# EAGLE design Test_Board (EAGLE 9.6.0)
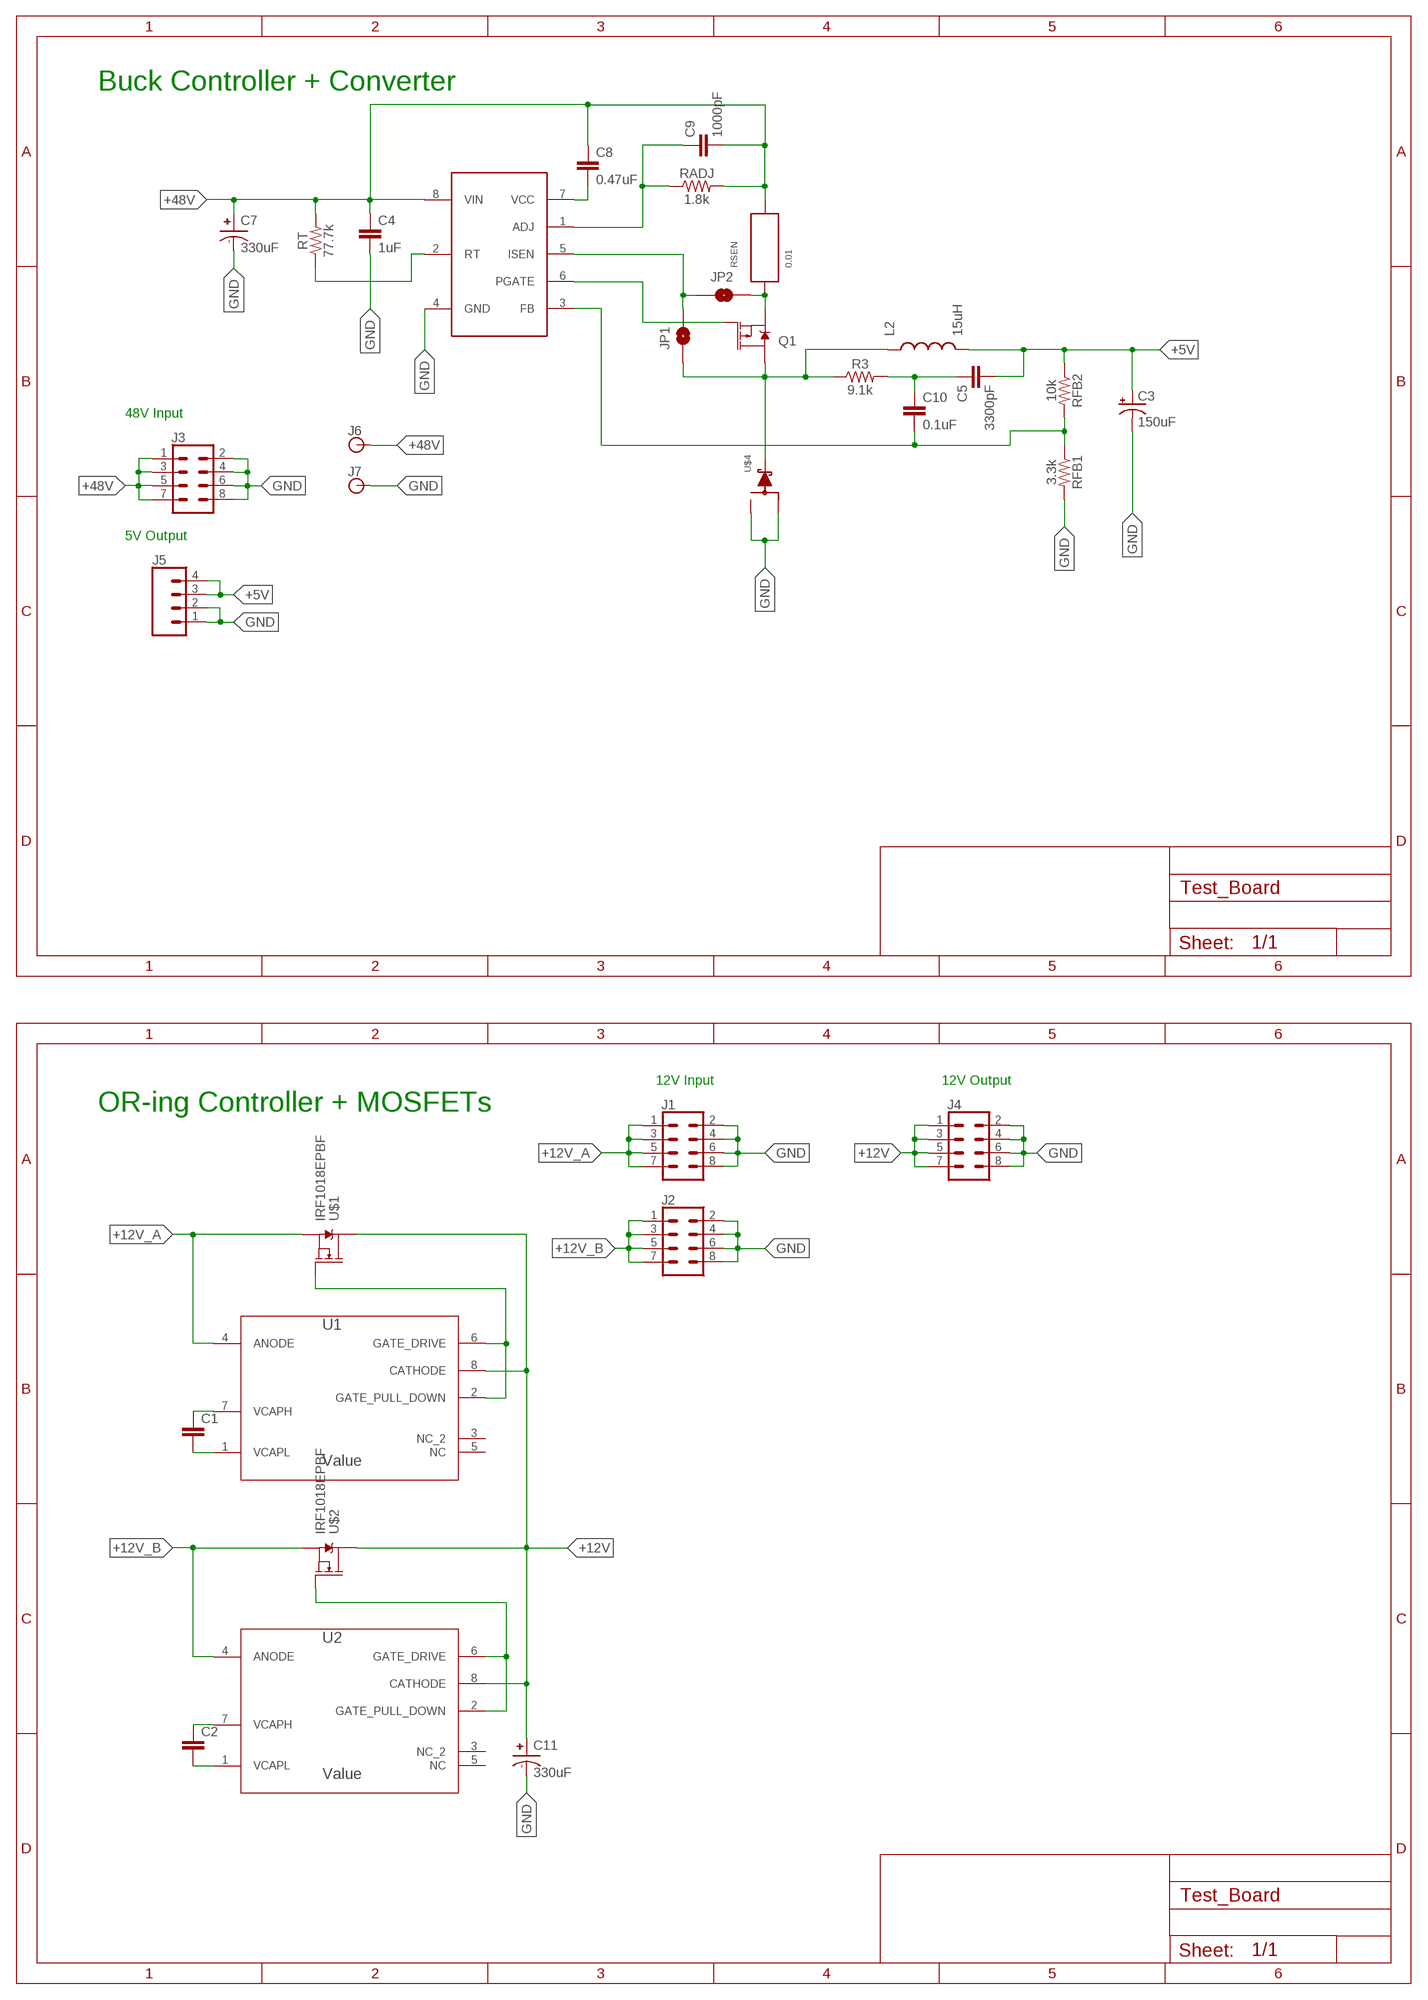
[diagram p0: schematic, sheet 1]

## Parts
C1  0.1UF-0603-100V-10%  [0603]
C2  0.1UF-0603-100V-10%  [0603]
C3  150uF  C-TANTALUM(10UF_150UF)  [CTAN(7.30_4.30MM)]
C4  1uF  0.1UF-0603-25V-(+80/-20%)  [0603]
C5  3300pF  0.1UF-0603-25V-(+80/-20%)  [0603]
C7  330uF  UCM1H331MNL1GS  [CAPAE1030X1050N]
C8  0.47uF  0.1UF-0603-25V-5%  [0603]
C9  1000pF  0.1UF-0603-25V-5%  [0603]
C10  0.1uF  0.1UF-0603-25V-(+80/-20%)  [0603]
C11  330uF  UCM1H331MNL1GS  [CAPAE1030X1050N]
J1  CONN_04X2  [2X4]
J2  CONN_04X2  [2X4]
J3  CONN_04X2  [2X4]
J4  CONN_04X2  [2X4]
J5  CONN_041X04_NO_SILK  [1X04_NO_SILK]
J6  BANANA_CONN  [BANANA_CONN]
J7  BANANA_CONN  [BANANA_CONN]
JP1  JUMPER-SMT_2_NO_NO-SILK  [SMT-JUMPER_2_NO_NO-SILK]
JP2  JUMPER-SMT_2_NO_NO-SILK  [SMT-JUMPER_2_NO_NO-SILK]
L2  15uH  HCMA1305  [HCMA1305]
Q1  MOSFET_PCH-NDS8434  [SO08]
R3  9.1k  RESISTOR0603  [0603]
RADJ  1.8k  RESISTOR0603  [0603]
RFB1  3.3k  RESISTOR0603  [0603]
RFB2  10k  RESISTOR0603  [0603]
RSEN  0.01  CSS2H-2512  [CSS2H-2512]
RT  77.7k  RESISTOR0603  [0603]
U1  Value  DIST_OR_DIODEDGK0008A_M  [DGK0008A_M]
U2  Value  DIST_OR_DIODEDGK0008A_M  [DGK0008A_M]
U$1  IRF1018EPBF  [TO263]
U$2  IRF1018EPBF  [TO263]
U$3  LM5085  [LM5085]
U$4  SWITCHMODE_SCHOTTKY  [DPAK-3]

## Nets
+5V: C3.+ C5.2 J5.3 J5.4 L2.2 RFB2.1
+12V: C11.+ J4.1 J4.3 J4.5 J4.7 U1.8(CATHODE) U2.8(CATHODE) U$1.3(D) U$2.3(D)
+12V_A: J1.1 J1.3 J1.5 J1.7 U1.4(ANODE) U$1.2(S)
+12V_B: J2.1 J2.3 J2.5 J2.7 U2.4(ANODE) U$2.2(S)
+48V: C4.1 C7.+ C8.1 C9.2 J3.1 J3.3 J3.5 J3.7 J6.P$1 RADJ.2 RSEN.2 RT.2 U$3.8(VIN)
FB: C10.2 RFB1.1 RFB2.2 U$3.3(FB)
GATE: Q1.4(G) U$3.6(PGATE)
GND: C3.- C4.2 C7.- C11.- J1.2 J1.4 J1.6 J1.8 J2.2 J2.4 J2.6 J2.8 J3.2 J3.4 J3.6 J3.8 J4.2 J4.4 J4.6 J4.8 J5.1 J5.2 J7.P$1 RFB1.2 U$3.4(GND) U$4.P$1 U$4.P$3
ISEN: JP1.2 JP2.1 U$3.5(ISEN)
N$2: C9.1 RADJ.1 U$3.1(ADJ)
N$5: C2.1 U2.7(VCAPH)
N$6: C2.2 U2.1(VCAPL)
N$7: C1.2 U1.1(VCAPL)
N$9: C1.1 U1.7(VCAPH)
N$10: U1.2(GATE_PULL_DOWN) U1.6(GATE_DRIVE) U$1.1(G)
N$12: C5.1 C10.1 R3.2
N$13: U2.2(GATE_PULL_DOWN) U2.6(GATE_DRIVE) U$2.1(G)
N$14: JP2.2 Q1.1(S) Q1.2(S) Q1.3(S) RSEN.1
RT: RT.1 U$3.2(RT)
SW: JP1.1 L2.1 Q1.5(D) Q1.6(D) Q1.7(D) Q1.8(D) R3.1 U$4.P$4
VCC: C8.2 U$3.7(VCC)
Unconnected: U1.3(NC_2) U1.5(NC) U2.3(NC_2) U2.5(NC)

## Notes on the sheet
- Buck Controller + Converter
- 48V Input
- 5V Output
- 12V Input | 12V Output
- OR-ing Controller + MOSFETs

## Library data of the parts
C1 C2 = SparkFun-Capacitors:0.1UF: 0.1µF ceramic capacitors A capacitor is a passive two-terminal electrical component used to store electrical energy temporarily in an electric field.; PROD_ID: CAP-08390; VALUE: 0.1uF
C3 = PowerComponents:C-TANTALUM(10UF_150UF)
C4 C5 = SparkFun-Capacitors:0.1UF: 0.1µF ceramic capacitors A capacitor is a passive two-terminal electrical component used to store electrical energy temporarily in an electric field.; PROD_ID: CAP-00810; VALUE: 0.1uF
C7 C11 = brick-capacitor-UCM1H331MNL1GS:UCM1H331MNL1GS: Nichicon 330uF 50 V Aluminium Electrolytic Capacitor SMD, CM Series 2000h 10 (Dia.) x 10mm Source: Datasheet <http://www.nichicon.co.jp/english/products/pdfs/e-ucm.pdf>; ARROW_PART_NUMBER: UCM1H331MNL1GS; ARROW_PRICE-STOCK: https://www.arrow.com/en/products/ucm1h331mnl1gs/nichicon; DESCRIPTION: Nichicon 330uF 50 V Aluminium Electrolytic Capacitor SMD, CM Series 2000h 10 (Dia.) x 10mm; HEIGHT: 10.5mm; MANUFACTURER_NAME: Nichicon; MANUFACTURER_PART_NUMBER: UCM1H331MNL1GS; MOUSER_PART_NUMBER: 647-UCM1H331MNL1GS; MOUSER_PRICE-STOCK: https://www.mouser.co.uk/ProductDetail/Nichicon/UCM1H331MNL1GS?qs=DSgADHjnLTkTovFLdbC%252BNg%3D%3D
C8 C9 = SparkFun-Capacitors:0.1UF: 0.1µF ceramic capacitors A capacitor is a passive two-terminal electrical component used to store electrical energy temporarily in an electric field.; PROD_ID: CAP-08604; VALUE: 0.1uF
C10 = SparkFun-Capacitors:0.1UF: 0.1µF ceramic capacitors A capacitor is a passive two-terminal electrical component used to store electrical energy temporarily in an electric field.; PROD_ID: CAP-00810
J1-J4 = SparkFun-Connectors:CONN_04X2: Multi connection point. Often used as Generic Header-pin footprint for 0.1 inch spaced/style header connections On any of the 0.1 inch spaced packages, you can populate with these: Break Away Headers - Straight <https://www.sparkfun.com/products/116> (PRT-00116) Break Away Male Headers - Right Angle <https://www.sparkfun.com/products/553> (PRT-00553) Female Headers <https://www.sparkfun.com/products/115> (PRT-00115) Break Away Headers - Machine Pin <https://www.sparkfun.com/products/117> (PRT-00117) Break Away Female Headers - Swiss Machine Pin <https://www.sparkfun.com/products/743> (PRT-00743)
J5 = SparkFun-Connectors:CONN_04: Multi connection point. Often used as Generic Header-pin footprint for 0.1 inch spaced/style header connections On any of the 0.1 inch spaced packages, you can populate with these: Break Away Headers - Straight <https://www.sparkfun.com/products/116> (PRT-00116) Break Away Male Headers - Right Angle <https://www.sparkfun.com/products/553> (PRT-00553) Female Headers <https://www.sparkfun.com/products/115> (PRT-00115) Break Away Headers - Machine Pin <https://www.sparkfun.com/products/117> (PRT-00117) Break Away Female Headers - Swiss Machine Pin <https://www.sparkfun.com/products/743> (PRT-00743) For SCREWTERMINALS and SPRING TERMINALS visit here: Screw Terimnals on SparkFun.com <https://www.sparkfun.com/search/results?term=Screw+Terminals> (5mm/3.5mm/2.54mm spacing) This device is also useful as a general connection point to wire up your design to another part of your project. Our various solder wires solder well into these plated through hole pads. Hook-Up Wire - Assortment (Stranded, 22 AWG) <https://www.sparkfun.com/products/11375> (PRT-11375) Hook-Up Wire - Assortment (Solid Core, 22 AWG) <https://www.sparkfun.com/products/11367> (PRT-11367) View the entire wire category on our website here <https://www.sparkfun.com/categories/141> Special notes: Molex polarized connector foot print use with SKU : PRT-08231 with associated crimp pins and housings. 1MM SMD Version SKU: PRT-10208; PROD_ID: CONN-09696
J6 J7 = SparkFun-Connectors:BANANA_CONN: Through-hole Banana Jack Basic PTH connection for banana jack plugs SparkFun Products: Multimeter Kit <https://www.sparkfun.com/products/retired/10956> Banana to Alligator Cable <https://www.sparkfun.com/products/retired/509> Banana to Alligator Coax Cable <https://www.sparkfun.com/products/retired/508> Banana to Banana Cable <https://www.sparkfun.com/products/retired/507> Banana to IC Hook Cables <https://www.sparkfun.com/products/retired/506>
JP1 JP2 = SparkFun-Jumpers:JUMPER-SMT_2_NO: Normally open jumper This jumper has two pads in close proximity to each other. Apply solder to close the connection. Round pads are easier to solder for beginners, but are a lot larger. SparkFun Product that uses the round pads: SparkFun EL Sequencer <https://www.sparkfun.com/products/12781>
L2 = Inductor_15uH - hcma1305:HCMA1305: Eaton HCMA1305-150-R Inductor
Q1 = SparkFun-DiscreteSemi:MOSFET_PCH: P-channel MOSFETs Voltage controlled devices that allow control of high current outputs. SparkFun Products: SparkFun ESP32 Thing <https://www.sparkfun.com/products/13907> SparkFun ESP8266 Thing <https://www.sparkfun.com/products/13231>; PROD_ID: TRANS-08355; VALUE: 6.5A/20V/35mΩ
R3 RADJ RFB1 RFB2 RT = SparkFun-Resistors:RESISTOR: Generic Resistor Package
RSEN = INA4181A4:CSS2H-2512
U1 U2 = Dist_OR_Controller:DIST_OR_DIODE; APPLICATION_BUILDNUMBER: *; COMPTYPE: IC; MANUFACTURER: Texas Instruments; MOUNTTYPE: SMT; PACKAGEREFERENCE: DGK0008A; PARTNUMBER: LM74610QDGKRQ1; PIN_COUNT: 8; REFDES: RefDes; TYPE: TYPE
U$1 U$2 = Reverse_Voltage_NMOS:IRF1018EPBF
U$3 = Buck_Controller:LM5085
U$4 = PowerComponents:SWITCHMODE_SCHOTTKY: {Digi-Key Part Number: MBRD835LT4GOSCT-ND} {Voltage - DC Reverse (Vr) (Max): 35V} {Current - Average Rectified (Io): 8A} {Voltage - Forward (Vf) (Max) @ If: 510mV @ 8A} {Speed: Fast Recovery =< 500ns, > 200mA (Io)} {Current - Reverse Leakage @ Vr: 1.4mA @ 35V} {Mounting Type: Surface Mount} {Package / Case: TO-252-3, DPak (2 Leads + Tab), SC-63} {Supplier Device Package: DPAK-3} {Operating Temperature - Junction: -65°C ~ 150°C}

## Board
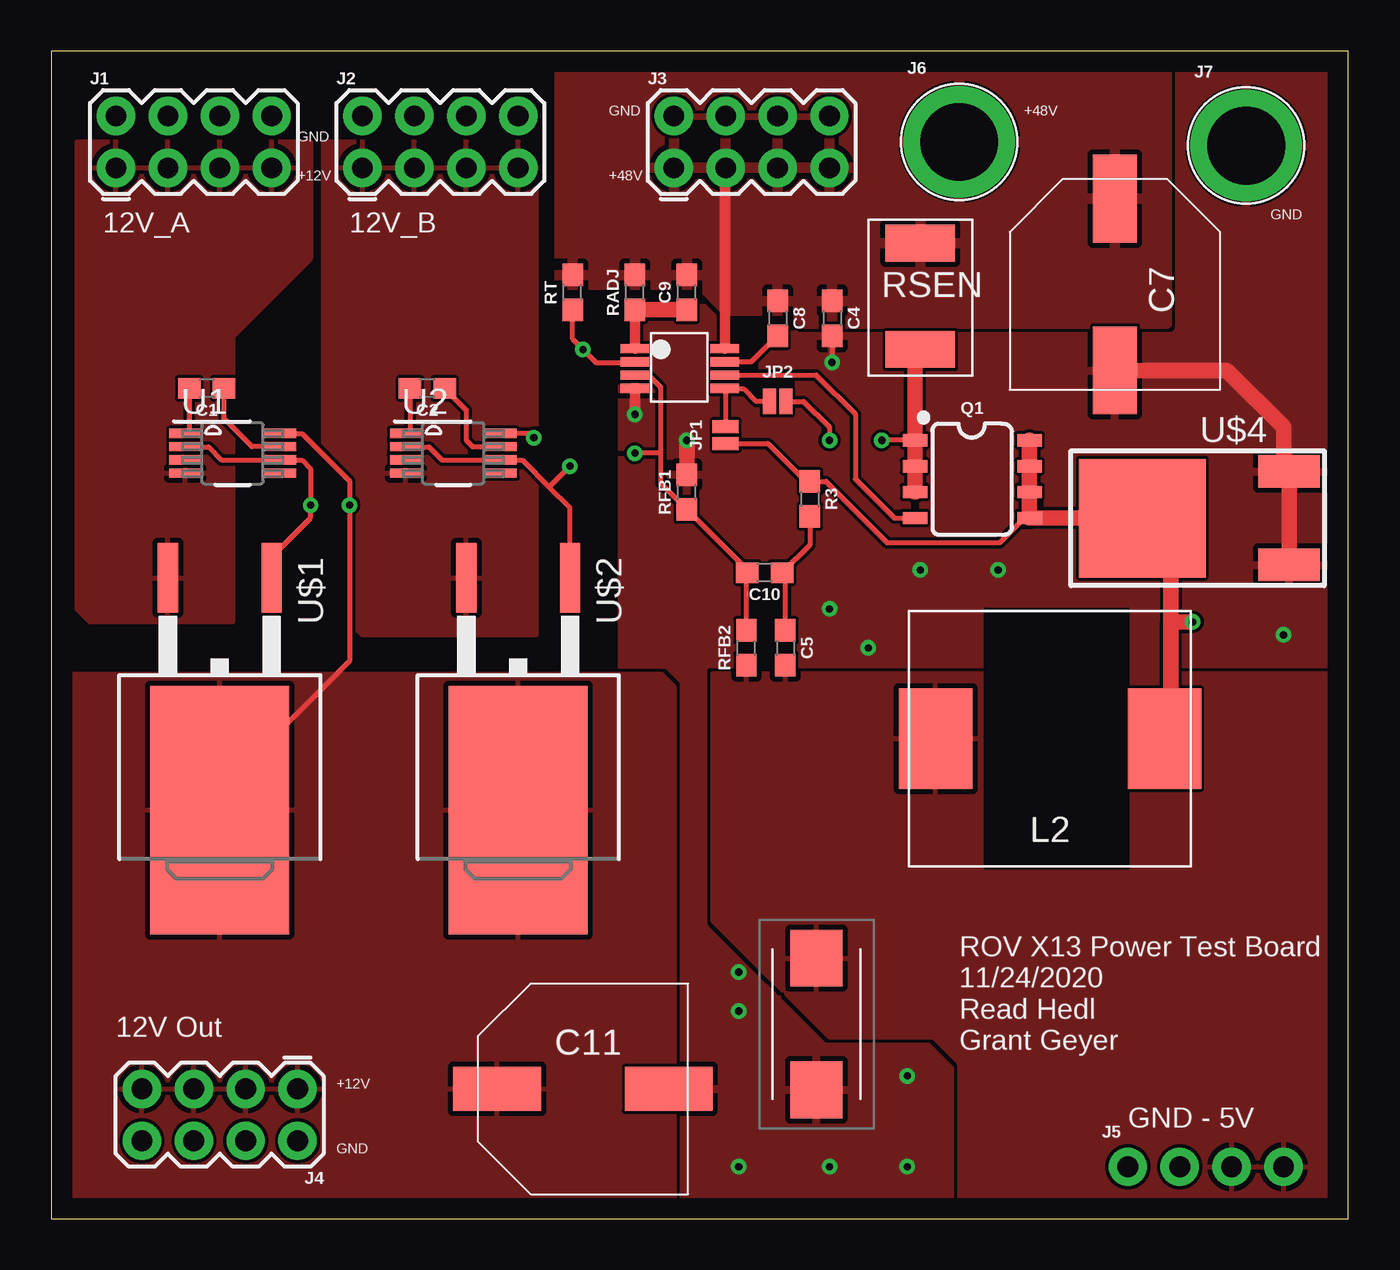
[diagram p1: board, top side]
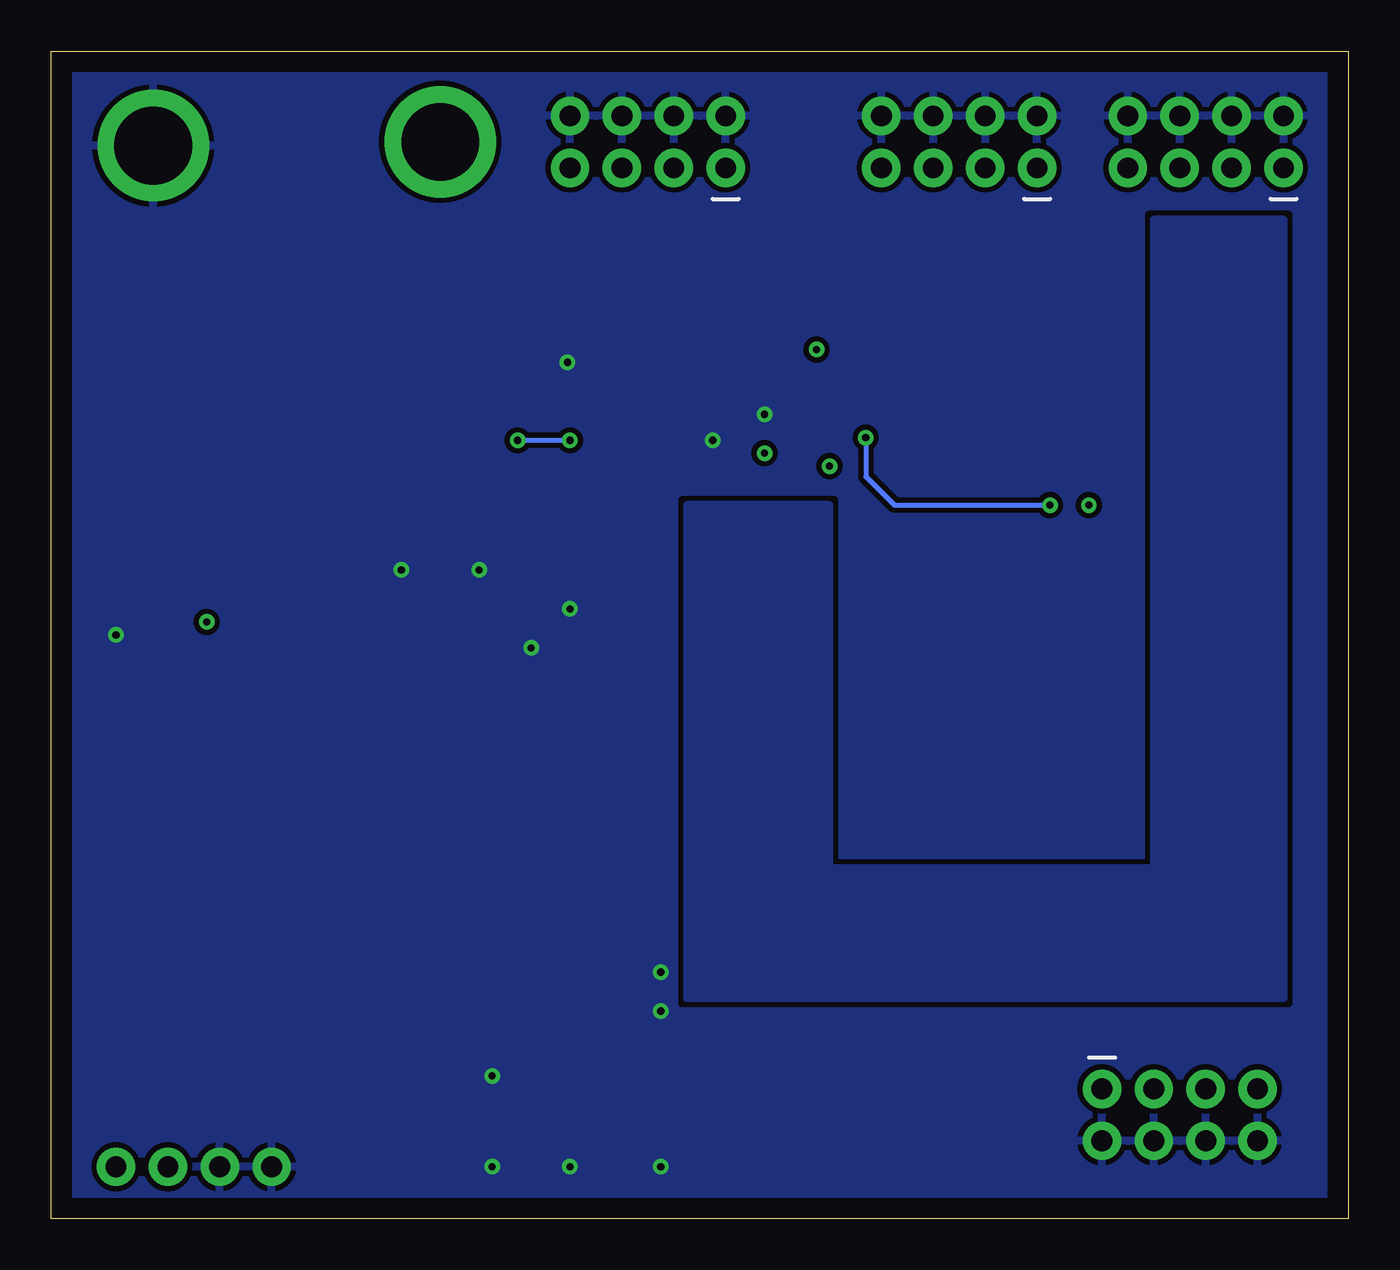
[diagram p2: board, bottom side, seen from below]

Size 63.5 x 57.15 mm. Coordinates in mm from the lower left corner, seen from the top.
Outline: 0,0 63.5,0 63.5,57.15 0,57.15 0,0
Copper layers (1*16): Top 0.035mm / dielectric 1.5mm / Bottom 0.035mm
Design rules "default": minimum track width 6mil, minimum drill 0.35mm, track to track 6mil, track to pad 6mil, pad to pad 6mil, via to via 6mil, smd to smd 6mil, copper to edge 40mil, drill to drill 6mil, minimum pad ring 10mil, minimum via ring 8mil, stop-mask expansion 4mil, vias tented up to drill 0mil, thermal gap 10mil

### Footprints (pad centres in the part's own frame; a part is rotated, then mirrored left to right if it is on the bottom)
0603 = smd 1.1 x 1: 1 -0.85,0; 2 0.85,0
CTAN(7.30_4.30MM) = smd 2.77 x 2.55: + -3.22,0; - 3.22,0
CAPAE1030X1050N = smd 4.3 x 2.15: + -4.2,0; - 4.2,0
2X4 = drill 1.016 pad 1.88: 1 -3.81,-1.27; 2 -3.81,1.27; 3 -1.27,-1.27; 4 -1.27,1.27; 5 1.27,-1.27; 6 1.27,1.27; 7 3.81,-1.27; 8 3.81,1.27
1X04_NO_SILK = drill 1.016 pad 1.88: 1 0,0; 2 2.54,0; 3 5.08,0; 4 7.62,0
BANANA_CONN = drill 3.81 pad 5.461: P$1 0,0
SMT-JUMPER_2_NO_NO-SILK = smd 0.635 x 1.27: 1 -0.406,0; 2 0.406,0
HCMA1305 = smd 3.6 x 4.9: 1 -5.6,0; 2 5.6,0
SO08 = smd 0.6 x 1.2: 1 -1.905,-2.8; 2 -0.635,-2.8; 3 0.635,-2.8; 4 1.905,-2.8; 5 1.905,2.8; 6 0.635,2.8; 7 -0.635,2.8; 8 -1.905,2.8
CSS2H-2512 = smd 3.4 x 1.8: 1 0,0; 2 0,5.2
DGK0008A_M = smd 1.55 x 0.45: 1 -2.325,0.975; 2 -2.325,0.325; 3 -2.325,-0.325; 4 -2.325,-0.975; 5 2.325,-0.975; 6 2.325,-0.325; 7 2.325,0.325; 8 2.325,0.975
TO263 = smd 1 x 3.4: 1 -2.54,-6.6; 2 2.54,-6.6 | smd 6.8 x 12.14: 3 0,4.77
LM5085 = smd 1.4 x 0.45: 1 0,1.95; 2 0,1.3; 3 0,0.65; 4 0,0; 5 4.4,0; 6 4.4,0.65; 7 4.4,1.3; 8 4.4,1.95
DPAK-3 = smd 3 x 1.6: P$1 4.08,-2.285; P$3 4.08,2.285 | smd 6.2 x 5.8: P$4 -3.1,0

### Placement (x,y rotation side)
C1  7.62,40.64 180 top
C2  18.41,40.64 180 top
C3  37.47,9.53 270 top
C4  38.23,44.07 270 top
C5  35.94,27.94 270 top
C7  52.07,45.72 270 top
C8  35.56,44.07 270 top
C9  31.11,45.34 90 top
C10  34.92,31.62 180 top
C11  26.04,6.35 0 top
J1  6.98,52.7 0 top
J2  19.05,52.7 0 top
J3  34.29,52.7 0 top
J4  8.25,5.08 180 top
J5  52.7,2.54 0 top
J6  44.45,52.7 0 top
J7  58.5,52.53 0 top
JP1  33.02,38.35 90 top
JP2  35.56,40.01 0 top
L2  48.89,23.5 180 top
Q1  45.08,36.2 270 top
R3  37.13,35.23 270 top
RADJ  28.57,45.34 90 top
RFB1  31.11,35.56 90 top
RFB2  34.04,27.94 90 top
RSEN  42.55,42.55 0 top
RT  25.53,45.34 90 top
U1  8.89,37.47 0 top
U2  19.68,37.47 0 top
U$1  8.25,24.77 180 top
U$2  22.86,24.77 180 top
U$3  28.57,40.64 0 top
U$4  56.52,34.29 0 top

### Tracks (layer width: path | path; a pad name or v marks a point on that pad's centre or on a via)
+5V
  pour Top: 44.45,0.64 62.86,0.64 62.86,26.67 32.38,26.67 32.38,14.61 38.1,8.89 43.18,8.89 44.45,7.62
+12V  (via drill 0.35)
  Top 0.254: U1.8 11.22,38.42 12.28,38.42 14.6,36.1 v14.6,34.92 14.6,27.3 8.25,20.95 U$1.3 | U2.8 23.41,38.44 v23.62,38.23
  Bottom 0.254: v23.62,38.23 23.62,36.32 22.23,34.92 v14.6,34.92
  pour Top: 0.63,0.64 0.63,26.67 29.84,26.67 30.48,26.04 30.48,0.64
+12V_A
  pour Top: 1.27,52.7 12.7,52.7 12.7,46.99 8.89,43.18 8.89,29.21 1.9,29.21 1.27,29.84
+12V_B
  pour Top: 13.33,52.7 23.75,52.7 23.75,28.57 15.24,28.57 13.33,30.48
+48V
  Top 0.508: U$3.8 32.97,51.39 J3.3
  pour Top: 24.89,45.72 31.75,45.72 33.02,44.45 36.2,44.45 36.83,43.81 54.61,43.81 54.61,56.52 24.89,56.52
FB  (via drill 0.35)
  Top 0.254: RFB2.2 34.04,31.58 C10.2 34.08,31.75 RFB1.1 29.84,35.98 29.84,37.47 | 29.84,37.47 29.84,40.69 29.25,41.29 U$3.3 | 29.84,37.47 v28.57,37.47
GATE
  Top 0.254: U$3.6 37.45,41.29 39.37,39.37 39.37,36.2 41.27,34.29 Q1.4
GND  (via drill 0.35)
  Top 0.254: C4.2 v38.23,41.91
  Top 0.508: U$3.4 v28.57,39.37
  Top 0.762: U$4.P$1 U$4.P$3 60.33,36.84 60.33,38.73 57.54,41.52 C7.- | RFB1.2 v31.11,38.1
  other vias: 38.1,29.84 40,27.94 46.36,31.75 42.55,31.75 38.1,2.54 41.91,6.99 33.66,2.54 33.66,10.16 33.66,12.06 41.91,2.54 60.33,28.57
  pour Bottom (isolate 0.254, rank 2): -1.27,58.42 64.77,58.42 64.77,-1.27 -1.27,-1.27
  pour Top (rank 6): 28.57,59.05 65.41,59.05 65.41,-1.91 27.94,-1.91 27.94,58.42
ISEN
  Top 0.254: U$3.5 33.02,40.59 | 33.02,40.59 JP1.2 | 33.02,40.59 33.93,40.59 34.52,40.01 JP2.1
N$2
  Top 0.508: U$3.1 RADJ.1
  Top 0.762: RADJ.1 C9.1
N$5
  Top 0.254: C2.1 20.32,39.59 20.32,38.1 20.63,37.79 U2.7
N$6
  Top 0.254: C2.2 17.56,38.55 U2.1
N$7
  Top 0.254: C1.2 6.77,38.55 U1.1
N$9
  Top 0.254: U1.7 9.83,37.79 8.47,39.16 C1.1
N$10  (via drill 0.35)
  Top 0.254: U1.2 6.6,37.77 7.7,37.77 8.34,37.14 U1.6 11.22,37.12 12.28,37.12 12.7,36.7 v12.7,34.92 12.7,34.29 10.79,32.38 U$1.1
N$12
  Top 0.254: R3.2 37.13,32.98 C10.1 35.92,31.48 35.94,31.46 C5.1
N$13  (via drill 0.35)
  Top 0.254: U2.2 17.39,37.77 18.5,37.77 19.13,37.14 U2.6 22.02,37.12 23.08,37.12 24.38,35.81 | 24.38,35.81 25.4,34.8 U$2.1 | 24.38,35.81 v25.4,36.83
N$14  (via drill 0.35)
  Top 0.254: JP2.2 36.83,40.01 38.1,38.73 v38.1,38.1 | Q1.1 v40.66,38.1
  Top 0.762: RSEN.1 42.28,42.28 Q1.1 Q1.2 Q1.3
  Bottom 0.254: v40.66,38.1 v38.1,38.1
RT  (via drill 0.35)
  Top 0.254: RT.1 25.53,43.05 v26.04,42.55 26.67,41.91 28.55,41.91 U$3.2
SW  (via drill 0.35)
  Top 0.254: JP1.1 35.08,37.95 36.95,36.08 R3.1 37.93,36.08 40.93,33.08 46.42,33.08 47.63,34.29 Q1.5
  Top 0.762: Q1.8 Q1.7 Q1.6 Q1.5 U$4.P$4 54.81,32.89 54.81,29.21 | 54.81,29.21 54.81,23.5 L2.1 | 54.81,29.21 v55.88,29.21
TEST
  pour Bottom: 3.17,10.79 3.17,48.9 9.52,48.9 9.52,17.14 25.4,17.14 25.4,34.92 32.38,34.92 32.38,10.79
VCC
  Top 0.254: C8.2 34.28,41.94 U$3.7
X
  cutout Top: 45.72,29.84 52.7,29.84 52.7,17.14 45.72,17.14

### Text on the board
tPlace: GND | +48V | GND | +12V | +48V | GND | 12V_A | 12V_B | 12V Out | +12V | GND
tNames: ROV X13 Power Test Board / 11/24/2020 / Read Hedl / Grant Geyer | GND - 5V